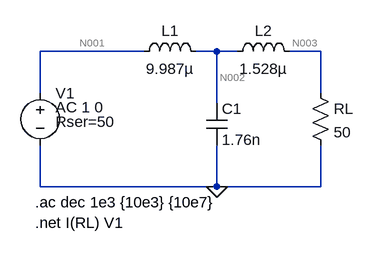
[diagram p0: schematic Draft23.asc]
Draft23.asc, the LTspice schematic file:
Version 4
SHEET 1 880 680
WIRE 192 224 32 224
WIRE 304 224 272 224
WIRE 336 224 304 224
WIRE 464 224 416 224
WIRE 32 288 32 224
WIRE 464 288 464 224
WIRE 304 304 304 224
WIRE 32 432 32 368
WIRE 304 432 304 368
WIRE 304 432 32 432
WIRE 464 432 464 368
WIRE 464 432 304 432
FLAG 304 432 0
SYMBOL voltage 32 272 R0
WINDOW 123 24 38 Left 2
WINDOW 39 24 60 Left 2
SYMATTR InstName V1
SYMATTR Value ""
SYMATTR Value2 AC 1 0
SYMATTR SpiceLine Rser=50
SYMBOL ind 176 240 R270
WINDOW 0 32 56 VTop 2
WINDOW 3 5 56 VBottom 2
SYMATTR InstName L1
SYMATTR Value 9.987µ
SYMBOL ind 320 240 R270
WINDOW 0 32 56 VTop 2
WINDOW 3 5 56 VBottom 2
SYMATTR InstName L2
SYMATTR Value 1.528µ
SYMBOL cap 288 304 R0
SYMATTR InstName C1
SYMATTR Value 1.76n
SYMBOL res 448 272 R0
SYMATTR InstName RL
SYMATTR Value 50
TEXT 24 456 Left 2 !.ac dec 1e3 {10e3} {10e7}\n.net I(RL) V1

The netlist it stands for:
* Draft23.asc
V1 N001 0 AC 1 0 Rser=50
L1 N001 N002 9.987µ
L2 N002 N003 1.528µ
C1 N002 0 1.76n
RL N003 0 50
.ac dec 1e3 {10e3} {10e7}
.net I(RL) V1
.backanno
.end

* Results of the author's LTspice run, read from the files saved beside the schematic
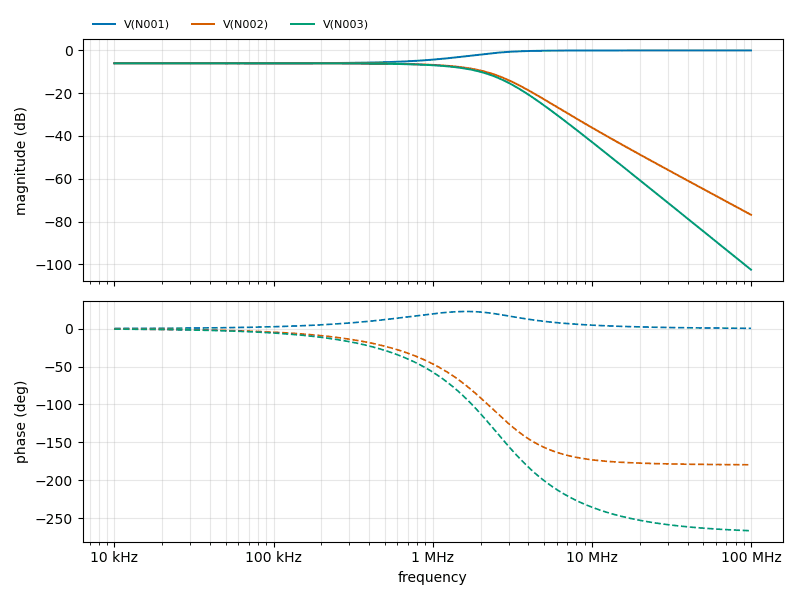
[diagram p1: AC Analysis of Draft23.asc, plotted from the saved traces]
* AC Analysis, 1 run:
*   V(N001): -6.02 dB at 10 kHz, -0.00 dB at 100 MHz, peak -0.00 dB at 100 MHz, 3 dB below the peak at 1.497 MHz
*   V(N002): -6.02 dB at 10 kHz, -76.82 dB at 100 MHz, peak -6.02 dB at 10 kHz, 3 dB below the peak at 1.893 MHz
*   V(N003): -6.02 dB at 10 kHz, -102.50 dB at 100 MHz, peak -6.02 dB at 10 kHz, 3 dB below the peak at 1.755 MHz